# Altium schematic sheet P02_Apollo 4 Plus.SchDoc
size C; SheetNumber: 2; SheetTotal: 3
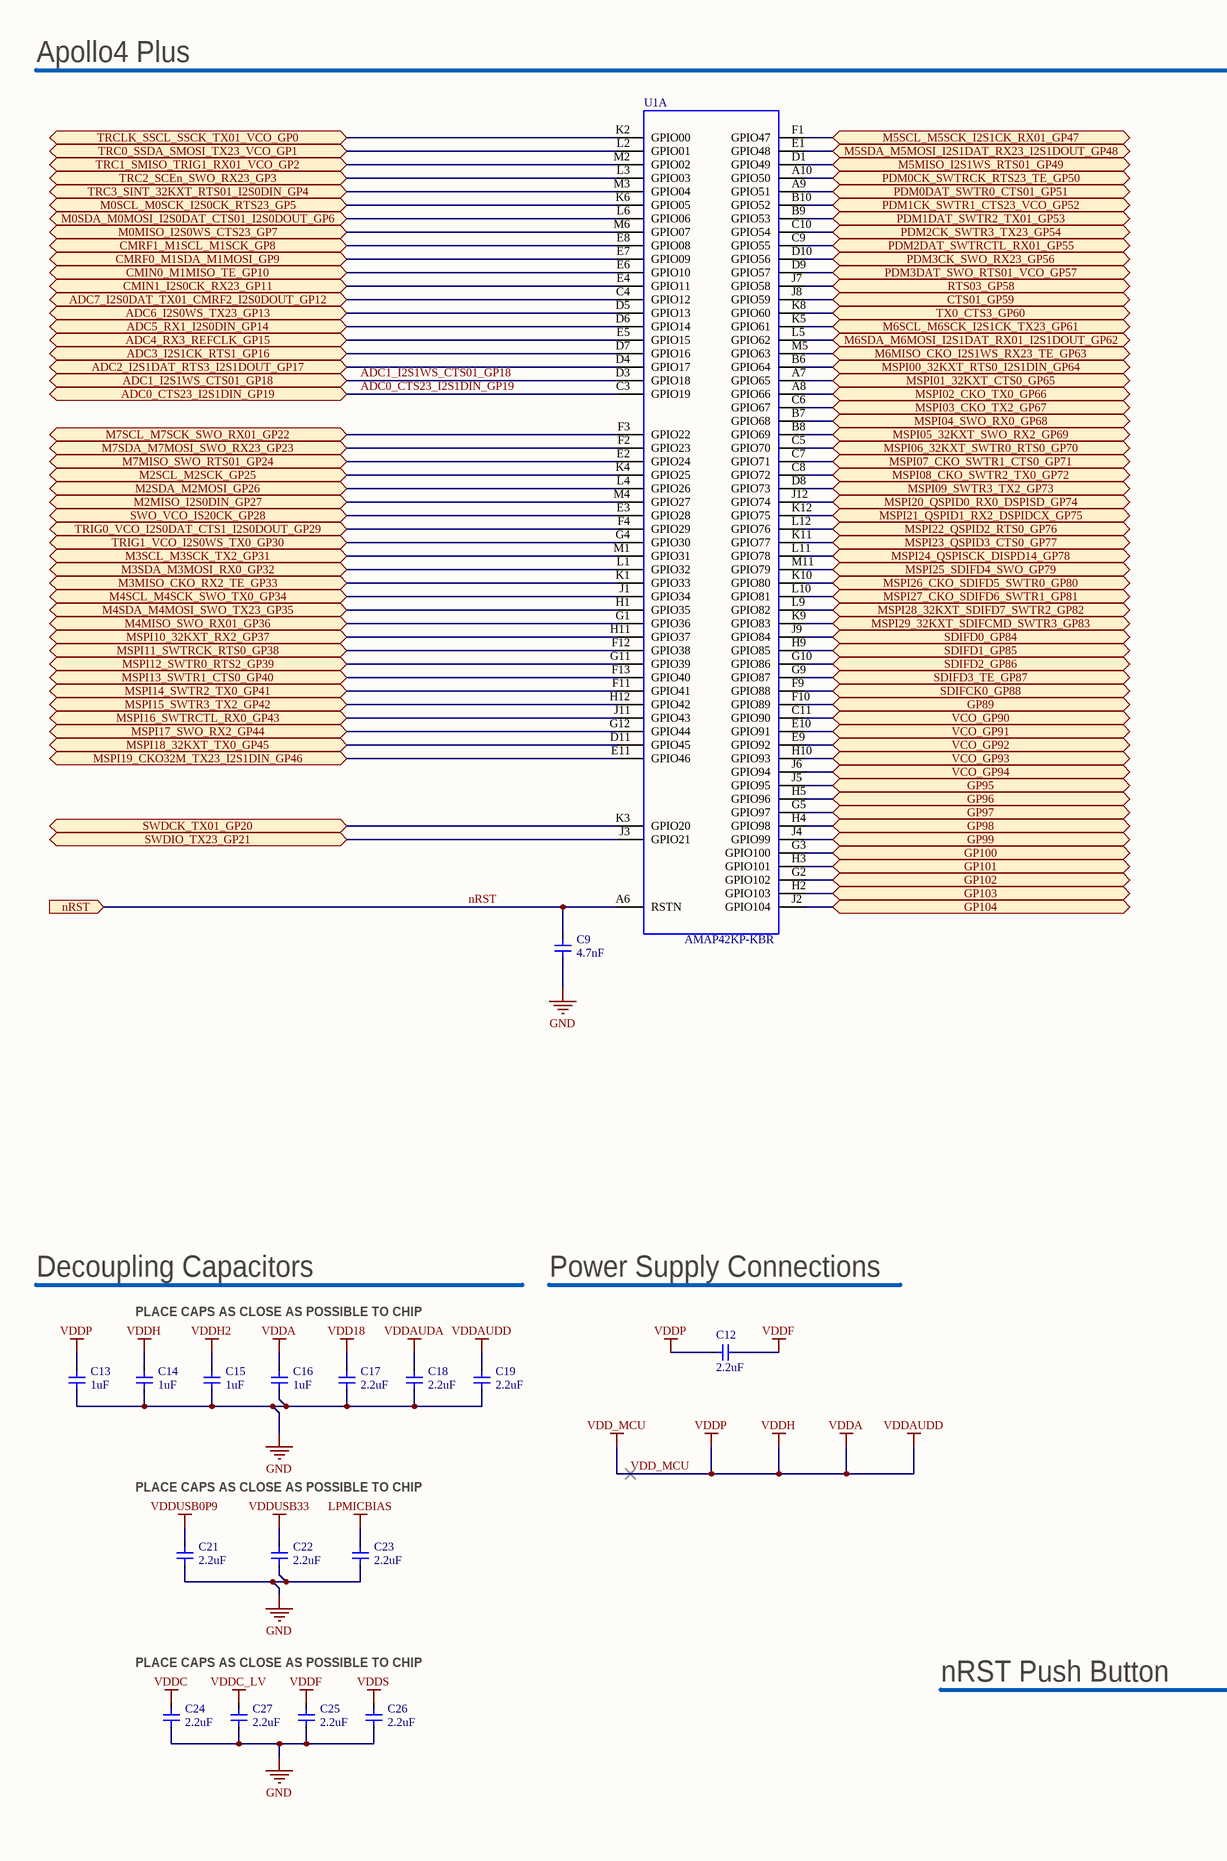
[diagram p0: P02_Apollo 4 Plus.SchDoc, left]
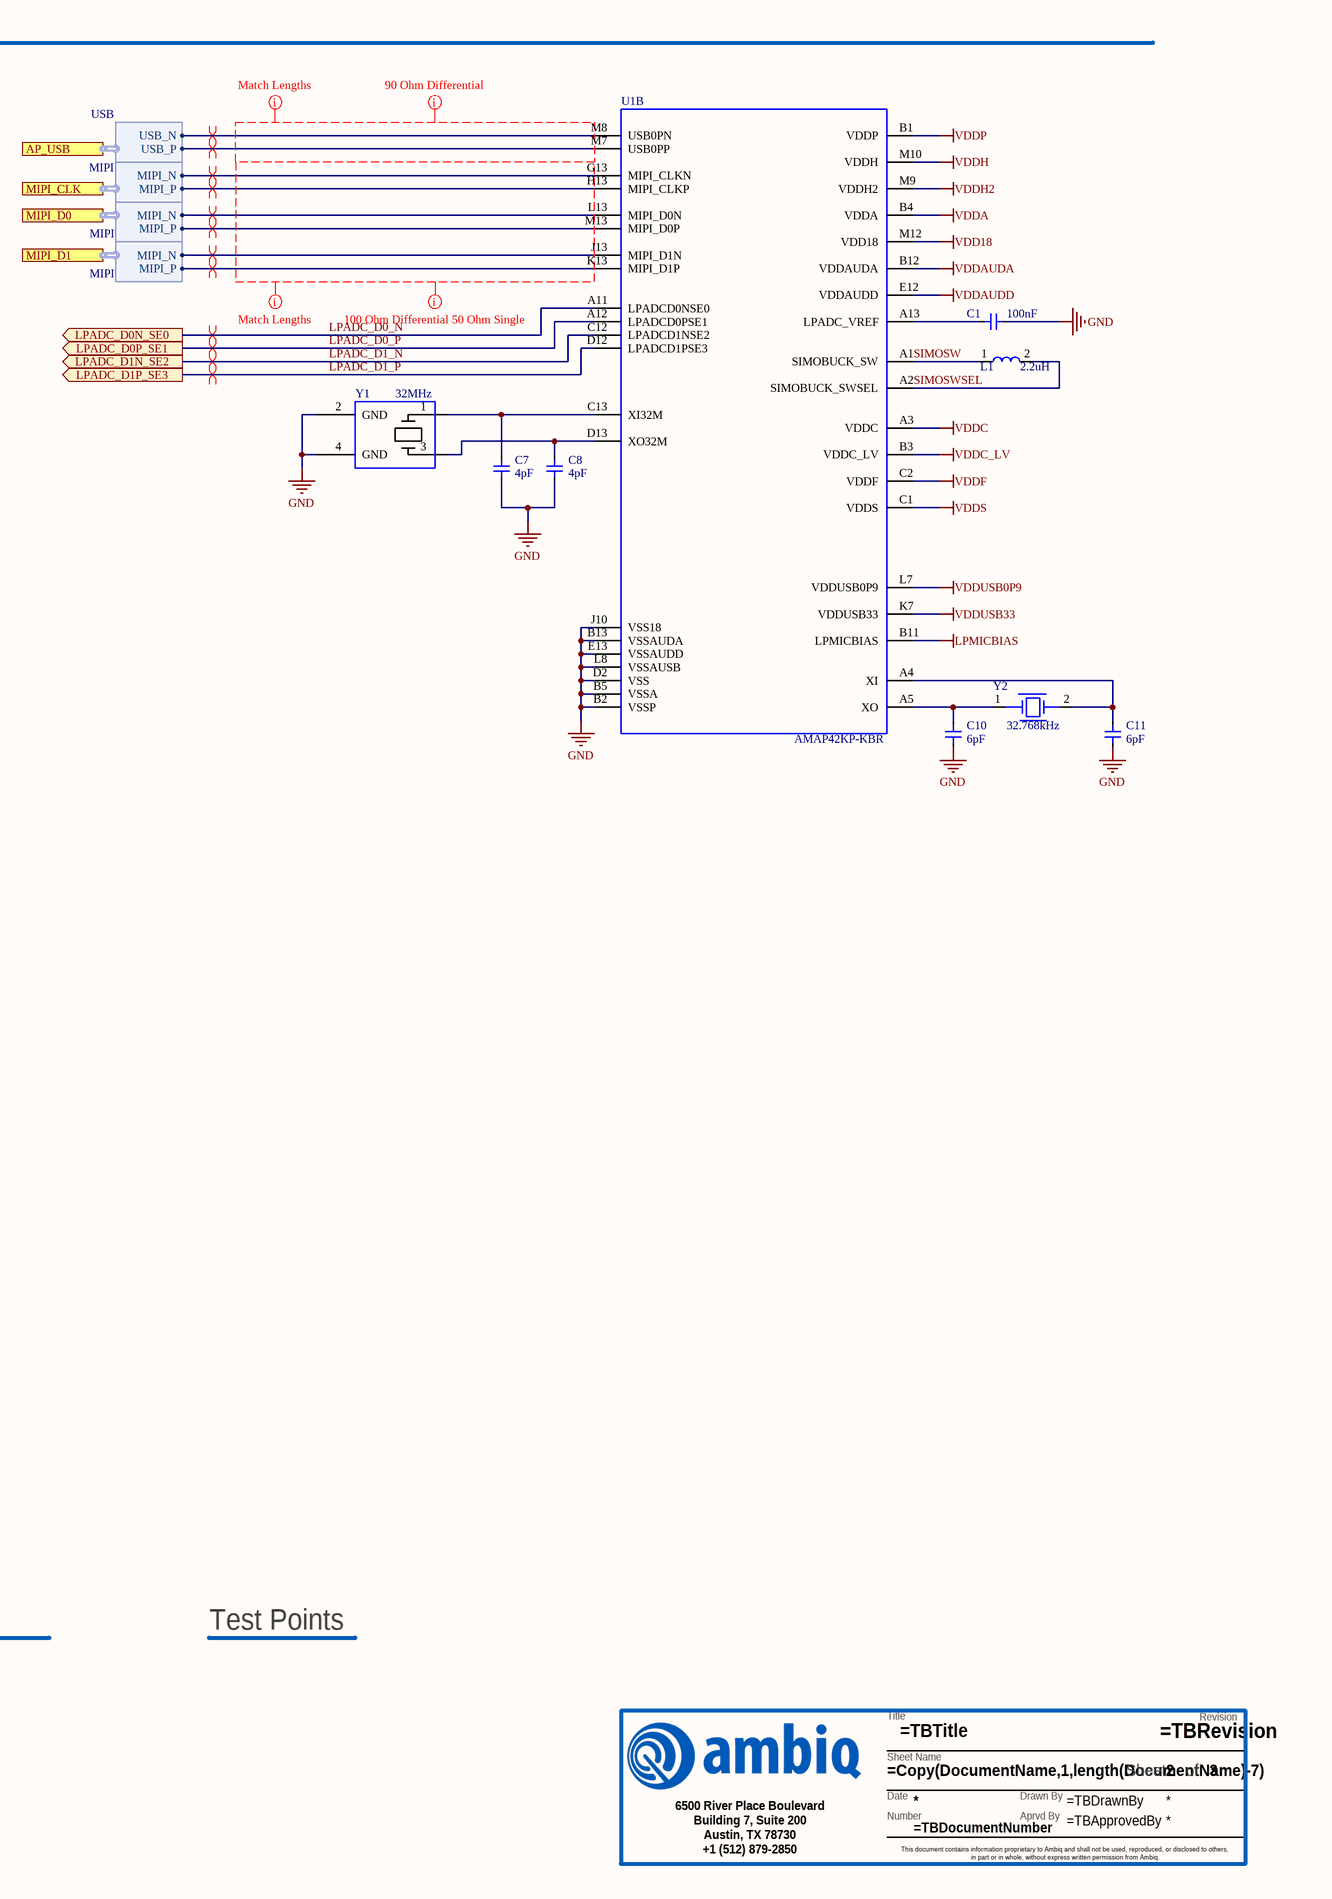
[diagram p1: P02_Apollo 4 Plus.SchDoc, right]

## Parts
?  TitleBlock  (value not drawn)  (graphical)
C1  100nF  [IPC_C]
C7  4pF  [IPC_C]
C8  4pF  [IPC_C]
C9  4.7nF  [IPC_C]
C10  6pF  [IPC_C]
C11  6pF  [IPC_C]
C12  2.2uF  [IPC_C]
C13  1uF  [IPC_C]
C14  1uF  [IPC_C]
C15  1uF  [IPC_C]
C16  1uF  [IPC_C]
C17  2.2uF  [IPC_C]
C18  2.2uF  [IPC_C]
C19  2.2uF  [IPC_C]
C21  2.2uF  [IPC_C]
C22  2.2uF  [IPC_C]
C23  2.2uF  [IPC_C]
C24  2.2uF  [IPC_C]
C25  2.2uF  [IPC_C]
C26  2.2uF  [IPC_C]
C27  2.2uF  [IPC_C]
L1  2.2uH  [IPC_C]
U1  AMAP42KP-KBR  [BGA146C35P13X12_390X430X350]  (parts A,B of 2)
Y1  32MHz  [XOSC_ABM12W_1.2x1.6]
Y2  32.768kHz  [XTAL2-1P6X1P0-SM]

## Ports
ADC0_CTS23_I2S1DIN_GP19 (bidir), ADC1_I2S1WS_CTS01_GP18 (bidir), ADC2_I2S1DAT_RTS3_I2S1DOUT_GP17 (bidir), ADC3_I2S1CK_RTS1_GP16 (bidir), ADC4_RX3_REFCLK_GP15 (bidir), ADC5_RX1_I2S0DIN_GP14 (bidir), ADC6_I2S0WS_TX23_GP13 (bidir), ADC7_I2S0DAT_TX01_CMRF2_I2S0DOUT_GP12 (bidir), AP_USB (harness USB), CMIN0_M1MISO_TE_GP10 (bidir), CMIN1_I2S0CK_RX23_GP11 (bidir), CMRF0_M1SDA_M1MOSI_GP9 (bidir), CMRF1_M1SCL_M1SCK_GP8 (bidir), CTS01_GP59 (bidir), GP89 (bidir), GP95 (bidir), GP96 (bidir), GP97 (bidir), GP98 (bidir), GP99 (bidir), GP100 (bidir), GP101 (bidir), GP102 (bidir), GP103 (bidir), GP104 (bidir), LPADC_D0N_SE0 (out), LPADC_D0P_SE1 (out), LPADC_D1N_SE2 (out), LPADC_D1P_SE3 (out), M0MISO_I2S0WS_CTS23_GP7 (bidir), M0SCL_M0SCK_I2S0CK_RTS23_GP5 (bidir), M0SDA_M0MOSI_I2S0DAT_CTS01_I2S0DOUT_GP6 (bidir), M2MISO_I2S0DIN_GP27 (bidir), M2SCL_M2SCK_GP25 (bidir), M2SDA_M2MOSI_GP26 (bidir), M3MISO_CKO_RX2_TE_GP33 (bidir), M3SCL_M3SCK_TX2_GP31 (bidir), M3SDA_M3MOSI_RX0_GP32 (bidir), M4MISO_SWO_RX01_GP36 (bidir), M4SCL_M4SCK_SWO_TX0_GP34 (bidir), M4SDA_M4MOSI_SWO_TX23_GP35 (bidir), M5MISO_I2S1WS_RTS01_GP49 (bidir), M5SCL_M5SCK_I2S1CK_RX01_GP47 (bidir), M5SDA_M5MOSI_I2S1DAT_RX23_I2S1DOUT_GP48 (bidir), M6MISO_CKO_I2S1WS_RX23_TE_GP63 (bidir), M6SCL_M6SCK_I2S1CK_TX23_GP61 (bidir), M6SDA_M6MOSI_I2S1DAT_RX01_I2S1DOUT_GP62 (bidir), M7MISO_SWO_RTS01_GP24 (bidir), M7SCL_M7SCK_SWO_RX01_GP22 (bidir), M7SDA_M7MOSI_SWO_RX23_GP23 (bidir), MIPI_CLK (harness MIPI), MIPI_D0 (harness MIPI), MIPI_D1 (harness MIPI), MSPI00_32KXT_RTS0_I2S1DIN_GP64 (bidir), MSPI01_32KXT_CTS0_GP65 (bidir), MSPI02_CKO_TX0_GP66 (bidir), MSPI03_CKO_TX2_GP67 (bidir), MSPI04_SWO_RX0_GP68 (bidir), MSPI05_32KXT_SWO_RX2_GP69 (bidir), MSPI06_32KXT_SWTR0_RTS0_GP70 (bidir), MSPI07_CKO_SWTR1_CTS0_GP71 (bidir), MSPI08_CKO_SWTR2_TX0_GP72 (bidir), MSPI09_SWTR3_TX2_GP73 (bidir), MSPI10_32KXT_RX2_GP37 (bidir), MSPI11_SWTRCK_RTS0_GP38 (bidir), MSPI12_SWTR0_RTS2_GP39 (bidir), MSPI13_SWTR1_CTS0_GP40 (bidir), MSPI14_SWTR2_TX0_GP41 (bidir), MSPI15_SWTR3_TX2_GP42 (bidir), MSPI16_SWTRCTL_RX0_GP43 (bidir), MSPI17_SWO_RX2_GP44 (bidir), MSPI18_32KXT_TX0_GP45 (bidir), MSPI19_CKO32M_TX23_I2S1DIN_GP46 (bidir), MSPI20_QSPID0_RX0_DSPISD_GP74 (bidir), MSPI21_QSPID1_RX2_DSPIDCX_GP75 (bidir), MSPI22_QSPID2_RTS0_GP76 (bidir), MSPI23_QSPID3_CTS0_GP77 (bidir), MSPI24_QSPISCK_DISPD14_GP78 (bidir), MSPI25_SDIFD4_SWO_GP79 (bidir), MSPI26_CKO_SDIFD5_SWTR0_GP80 (bidir), MSPI27_CKO_SDIFD6_SWTR1_GP81 (bidir), MSPI28_32KXT_SDIFD7_SWTR2_GP82 (bidir), MSPI29_32KXT_SDIFCMD_SWTR3_GP83 (bidir), nRST (in), PDM0CK_SWTRCK_RTS23_TE_GP50 (bidir), PDM0DAT_SWTR0_CTS01_GP51 (bidir), PDM1CK_SWTR1_CTS23_VCO_GP52 (bidir), PDM1DAT_SWTR2_TX01_GP53 (bidir), PDM2CK_SWTR3_TX23_GP54 (bidir), PDM2DAT_SWTRCTL_RX01_GP55 (bidir), PDM3CK_SWO_RX23_GP56 (bidir), PDM3DAT_SWO_RTS01_VCO_GP57 (bidir), RTS03_GP58 (bidir), SDIFCK0_GP88 (bidir), SDIFD0_GP84 (bidir), SDIFD1_GP85 (bidir), SDIFD2_GP86 (bidir), SDIFD3_TE_GP87 (bidir), SWDCK_TX01_GP20 (bidir), SWDIO_TX23_GP21 (bidir), SWO_VCO_IS20CK_GP28 (bidir), TRC0_SSDA_SMOSI_TX23_VCO_GP1 (bidir), TRC1_SMISO_TRIG1_RX01_VCO_GP2 (bidir), TRC2_SCEn_SWO_RX23_GP3 (bidir), TRC3_SINT_32KXT_RTS01_I2S0DIN_GP4 (bidir), TRCLK_SSCL_SSCK_TX01_VCO_GP0 (bidir), TRIG0_VCO_I2S0DAT_CTS1_I2S0DOUT_GP29 (bidir), TRIG1_VCO_I2S0WS_TX0_GP30 (bidir), TX0_CTS3_GP60 (bidir), VCO_GP90 (bidir), VCO_GP91 (bidir), VCO_GP92 (bidir), VCO_GP93 (bidir), VCO_GP94 (bidir)

## Harnesses
USB: USB_N, USB_P
MIPI: MIPI_N, MIPI_P

## Nets
GND: C1.2 C7.2 C8.2 C9.2 C10.2 C11.2 C13.2 C14.2 C15.2 C16.2 C17.2 C18.2 C19.2 C21.2 C22.2 C23.2 C24.2 C25.2 C26.2 C27.2 U1.B2(VSSP) U1.B5(VSSA) U1.B13(VSSAUDA) U1.D2(VSS) U1.E13(VSSAUDD) U1.J10(VSS18) U1.L8(VSSAUSB) Y1.2(GND) Y1.4(GND)
LPMICBIAS: C23.1 U1.B11(LPMICBIAS)
VDD18: C17.1 U1.M12(VDD18)
VDD_MCU: C12.1 C13.1 C14.1 C16.1 C19.1 U1.B1(VDDP) U1.B4(VDDA) U1.E12(VDDAUDD) U1.M10(VDDH)  [also labelled VDDA, VDDAUDD, VDDH, VDDP]
VDDAUDA: C18.1 U1.B12(VDDAUDA)
VDDC: C24.1 U1.A3(VDDC)
VDDC_LV: C27.1 U1.B3(VDDC_LV)
VDDF: C12.2 C25.1 U1.C2(VDDF)
VDDH2: C15.1 U1.M9(VDDH2)
VDDS: C26.1 U1.C1(VDDS)
VDDUSB0P9: C21.1 U1.L7(VDDUSB0P9)
VDDUSB33: C22.1 U1.K7(VDDUSB33)
ADC0_CTS23_I2S1DIN_GP19: U1.C3(GPIO19) ; port ADC0_CTS23_I2S1DIN_GP19
ADC1_I2S1WS_CTS01_GP18: U1.D3(GPIO18) ; port ADC1_I2S1WS_CTS01_GP18
ADC2_I2S1DAT_RTS3_I2S1DOUT_GP17: U1.D4(GPIO17) ; port ADC2_I2S1DAT_RTS3_I2S1DOUT_GP17
ADC3_I2S1CK_RTS1_GP16: U1.D7(GPIO16) ; port ADC3_I2S1CK_RTS1_GP16
ADC4_RX3_REFCLK_GP15: U1.E5(GPIO15) ; port ADC4_RX3_REFCLK_GP15
ADC5_RX1_I2S0DIN_GP14: U1.D6(GPIO14) ; port ADC5_RX1_I2S0DIN_GP14
ADC6_I2S0WS_TX23_GP13: U1.D5(GPIO13) ; port ADC6_I2S0WS_TX23_GP13
ADC7_I2S0DAT_TX01_CMRF2_I2S0DOUT_GP12: U1.C4(GPIO12) ; port ADC7_I2S0DAT_TX01_CMRF2_I2S0DOUT_GP12
CMIN0_M1MISO_TE_GP10: U1.E6(GPIO10) ; port CMIN0_M1MISO_TE_GP10
CMIN1_I2S0CK_RX23_GP11: U1.E4(GPIO11) ; port CMIN1_I2S0CK_RX23_GP11
CMRF0_M1SDA_M1MOSI_GP9: U1.E7(GPIO09) ; port CMRF0_M1SDA_M1MOSI_GP9
CMRF1_M1SCL_M1SCK_GP8: U1.E8(GPIO08) ; port CMRF1_M1SCL_M1SCK_GP8
CTS01_GP59: U1.J8(GPIO59) ; port CTS01_GP59
GP89: U1.F10(GPIO89) ; port GP89
GP95: U1.J5(GPIO95) ; port GP95
GP96: U1.H5(GPIO96) ; port GP96
GP97: U1.G5(GPIO97) ; port GP97
GP98: U1.H4(GPIO98) ; port GP98
GP99: U1.J4(GPIO99) ; port GP99
GP100: U1.G3(GPIO100) ; port GP100
GP101: U1.H3(GPIO101) ; port GP101
GP102: U1.G2(GPIO102) ; port GP102
GP103: U1.H2(GPIO103) ; port GP103
GP104: U1.J2(GPIO104) ; port GP104
LPADC_D0_N: U1.A11(LPADCD0NSE0) ; port LPADC_D0N_SE0
LPADC_D0_P: U1.A12(LPADCD0PSE1) ; port LPADC_D0P_SE1
LPADC_D1_N: U1.C12(LPADCD1NSE2) ; port LPADC_D1N_SE2
LPADC_D1_P: U1.D12(LPADCD1PSE3) ; port LPADC_D1P_SE3
M0MISO_I2S0WS_CTS23_GP7: U1.M6(GPIO07) ; port M0MISO_I2S0WS_CTS23_GP7
M0SCL_M0SCK_I2S0CK_RTS23_GP5: U1.K6(GPIO05) ; port M0SCL_M0SCK_I2S0CK_RTS23_GP5
M0SDA_M0MOSI_I2S0DAT_CTS01_I2S0DOUT_GP6: U1.L6(GPIO06) ; port M0SDA_M0MOSI_I2S0DAT_CTS01_I2S0DOUT_GP6
M2MISO_I2S0DIN_GP27: U1.M4(GPIO27) ; port M2MISO_I2S0DIN_GP27
M2SCL_M2SCK_GP25: U1.K4(GPIO25) ; port M2SCL_M2SCK_GP25
M2SDA_M2MOSI_GP26: U1.L4(GPIO26) ; port M2SDA_M2MOSI_GP26
M3MISO_CKO_RX2_TE_GP33: U1.K1(GPIO33) ; port M3MISO_CKO_RX2_TE_GP33
M3SCL_M3SCK_TX2_GP31: U1.M1(GPIO31) ; port M3SCL_M3SCK_TX2_GP31
M3SDA_M3MOSI_RX0_GP32: U1.L1(GPIO32) ; port M3SDA_M3MOSI_RX0_GP32
M4MISO_SWO_RX01_GP36: U1.G1(GPIO36) ; port M4MISO_SWO_RX01_GP36
M4SCL_M4SCK_SWO_TX0_GP34: U1.J1(GPIO34) ; port M4SCL_M4SCK_SWO_TX0_GP34
M4SDA_M4MOSI_SWO_TX23_GP35: U1.H1(GPIO35) ; port M4SDA_M4MOSI_SWO_TX23_GP35
M5MISO_I2S1WS_RTS01_GP49: U1.D1(GPIO49) ; port M5MISO_I2S1WS_RTS01_GP49
M5SCL_M5SCK_I2S1CK_RX01_GP47: U1.F1(GPIO47) ; port M5SCL_M5SCK_I2S1CK_RX01_GP47
M5SDA_M5MOSI_I2S1DAT_RX23_I2S1DOUT_GP48: U1.E1(GPIO48) ; port M5SDA_M5MOSI_I2S1DAT_RX23_I2S1DOUT_GP48
M6MISO_CKO_I2S1WS_RX23_TE_GP63: U1.M5(GPIO63) ; port M6MISO_CKO_I2S1WS_RX23_TE_GP63
M6SCL_M6SCK_I2S1CK_TX23_GP61: U1.K5(GPIO61) ; port M6SCL_M6SCK_I2S1CK_TX23_GP61
M6SDA_M6MOSI_I2S1DAT_RX01_I2S1DOUT_GP62: U1.L5(GPIO62) ; port M6SDA_M6MOSI_I2S1DAT_RX01_I2S1DOUT_GP62
M7MISO_SWO_RTS01_GP24: U1.E2(GPIO24) ; port M7MISO_SWO_RTS01_GP24
M7SCL_M7SCK_SWO_RX01_GP22: U1.F3(GPIO22) ; port M7SCL_M7SCK_SWO_RX01_GP22
M7SDA_M7MOSI_SWO_RX23_GP23: U1.F2(GPIO23) ; port M7SDA_M7MOSI_SWO_RX23_GP23
MSPI00_32KXT_RTS0_I2S1DIN_GP64: U1.B6(GPIO64) ; port MSPI00_32KXT_RTS0_I2S1DIN_GP64
MSPI01_32KXT_CTS0_GP65: U1.A7(GPIO65) ; port MSPI01_32KXT_CTS0_GP65
MSPI02_CKO_TX0_GP66: U1.A8(GPIO66) ; port MSPI02_CKO_TX0_GP66
MSPI03_CKO_TX2_GP67: U1.C6(GPIO67) ; port MSPI03_CKO_TX2_GP67
MSPI04_SWO_RX0_GP68: U1.B7(GPIO68) ; port MSPI04_SWO_RX0_GP68
MSPI05_32KXT_SWO_RX2_GP69: U1.B8(GPIO69) ; port MSPI05_32KXT_SWO_RX2_GP69
MSPI06_32KXT_SWTR0_RTS0_GP70: U1.C5(GPIO70) ; port MSPI06_32KXT_SWTR0_RTS0_GP70
MSPI07_CKO_SWTR1_CTS0_GP71: U1.C7(GPIO71) ; port MSPI07_CKO_SWTR1_CTS0_GP71
MSPI08_CKO_SWTR2_TX0_GP72: U1.C8(GPIO72) ; port MSPI08_CKO_SWTR2_TX0_GP72
MSPI09_SWTR3_TX2_GP73: U1.D8(GPIO73) ; port MSPI09_SWTR3_TX2_GP73
MSPI10_32KXT_RX2_GP37: U1.H11(GPIO37) ; port MSPI10_32KXT_RX2_GP37
MSPI11_SWTRCK_RTS0_GP38: U1.F12(GPIO38) ; port MSPI11_SWTRCK_RTS0_GP38
MSPI12_SWTR0_RTS2_GP39: U1.G11(GPIO39) ; port MSPI12_SWTR0_RTS2_GP39
MSPI13_SWTR1_CTS0_GP40: U1.F13(GPIO40) ; port MSPI13_SWTR1_CTS0_GP40
MSPI14_SWTR2_TX0_GP41: U1.F11(GPIO41) ; port MSPI14_SWTR2_TX0_GP41
MSPI15_SWTR3_TX2_GP42: U1.H12(GPIO42) ; port MSPI15_SWTR3_TX2_GP42
MSPI16_SWTRCTL_RX0_GP43: U1.J11(GPIO43) ; port MSPI16_SWTRCTL_RX0_GP43
MSPI17_SWO_RX2_GP44: U1.G12(GPIO44) ; port MSPI17_SWO_RX2_GP44
MSPI18_32KXT_TX0_GP45: U1.D11(GPIO45) ; port MSPI18_32KXT_TX0_GP45
MSPI19_CKO32M_TX23_I2S1DIN_GP46: U1.E11(GPIO46) ; port MSPI19_CKO32M_TX23_I2S1DIN_GP46
MSPI20_QSPID0_RX0_DSPISD_GP74: U1.J12(GPIO74) ; port MSPI20_QSPID0_RX0_DSPISD_GP74
MSPI21_QSPID1_RX2_DSPIDCX_GP75: U1.K12(GPIO75) ; port MSPI21_QSPID1_RX2_DSPIDCX_GP75
MSPI22_QSPID2_RTS0_GP76: U1.L12(GPIO76) ; port MSPI22_QSPID2_RTS0_GP76
MSPI23_QSPID3_CTS0_GP77: U1.K11(GPIO77) ; port MSPI23_QSPID3_CTS0_GP77
MSPI24_QSPISCK_DISPD14_GP78: U1.L11(GPIO78) ; port MSPI24_QSPISCK_DISPD14_GP78
MSPI25_SDIFD4_SWO_GP79: U1.M11(GPIO79) ; port MSPI25_SDIFD4_SWO_GP79
MSPI26_CKO_SDIFD5_SWTR0_GP80: U1.K10(GPIO80) ; port MSPI26_CKO_SDIFD5_SWTR0_GP80
MSPI27_CKO_SDIFD6_SWTR1_GP81: U1.L10(GPIO81) ; port MSPI27_CKO_SDIFD6_SWTR1_GP81
MSPI28_32KXT_SDIFD7_SWTR2_GP82: U1.L9(GPIO82) ; port MSPI28_32KXT_SDIFD7_SWTR2_GP82
MSPI29_32KXT_SDIFCMD_SWTR3_GP83: U1.K9(GPIO83) ; port MSPI29_32KXT_SDIFCMD_SWTR3_GP83
nRST: C9.1 U1.A6(RSTN) ; port nRST
PDM0CK_SWTRCK_RTS23_TE_GP50: U1.A10(GPIO50) ; port PDM0CK_SWTRCK_RTS23_TE_GP50
PDM0DAT_SWTR0_CTS01_GP51: U1.A9(GPIO51) ; port PDM0DAT_SWTR0_CTS01_GP51
PDM1CK_SWTR1_CTS23_VCO_GP52: U1.B10(GPIO52) ; port PDM1CK_SWTR1_CTS23_VCO_GP52
PDM1DAT_SWTR2_TX01_GP53: U1.B9(GPIO53) ; port PDM1DAT_SWTR2_TX01_GP53
PDM2CK_SWTR3_TX23_GP54: U1.C10(GPIO54) ; port PDM2CK_SWTR3_TX23_GP54
PDM2DAT_SWTRCTL_RX01_GP55: U1.C9(GPIO55) ; port PDM2DAT_SWTRCTL_RX01_GP55
PDM3CK_SWO_RX23_GP56: U1.D10(GPIO56) ; port PDM3CK_SWO_RX23_GP56
PDM3DAT_SWO_RTS01_VCO_GP57: U1.D9(GPIO57) ; port PDM3DAT_SWO_RTS01_VCO_GP57
RTS03_GP58: U1.J7(GPIO58) ; port RTS03_GP58
SDIFCK0_GP88: U1.F9(GPIO88) ; port SDIFCK0_GP88
SDIFD0_GP84: U1.J9(GPIO84) ; port SDIFD0_GP84
SDIFD1_GP85: U1.H9(GPIO85) ; port SDIFD1_GP85
SDIFD2_GP86: U1.G10(GPIO86) ; port SDIFD2_GP86
SDIFD3_TE_GP87: U1.G9(GPIO87) ; port SDIFD3_TE_GP87
SIMOSW: L1.1 U1.A1(SIMOBUCK_SW)
SIMOSWSEL: L1.2 U1.A2(SIMOBUCK_SWSEL)
SWDCK_TX01_GP20: U1.K3(GPIO20) ; port SWDCK_TX01_GP20
SWDIO_TX23_GP21: U1.J3(GPIO21) ; port SWDIO_TX23_GP21
SWO_VCO_IS20CK_GP28: U1.E3(GPIO28) ; port SWO_VCO_IS20CK_GP28
TRC0_SSDA_SMOSI_TX23_VCO_GP1: U1.L2(GPIO01) ; port TRC0_SSDA_SMOSI_TX23_VCO_GP1
TRC1_SMISO_TRIG1_RX01_VCO_GP2: U1.M2(GPIO02) ; port TRC1_SMISO_TRIG1_RX01_VCO_GP2
TRC2_SCEn_SWO_RX23_GP3: U1.L3(GPIO03) ; port TRC2_SCEn_SWO_RX23_GP3
TRC3_SINT_32KXT_RTS01_I2S0DIN_GP4: U1.M3(GPIO04) ; port TRC3_SINT_32KXT_RTS01_I2S0DIN_GP4
TRCLK_SSCL_SSCK_TX01_VCO_GP0: U1.K2(GPIO00) ; port TRCLK_SSCL_SSCK_TX01_VCO_GP0
TRIG0_VCO_I2S0DAT_CTS1_I2S0DOUT_GP29: U1.F4(GPIO29) ; port TRIG0_VCO_I2S0DAT_CTS1_I2S0DOUT_GP29
TRIG1_VCO_I2S0WS_TX0_GP30: U1.G4(GPIO30) ; port TRIG1_VCO_I2S0WS_TX0_GP30
TX0_CTS3_GP60: U1.K8(GPIO60) ; port TX0_CTS3_GP60
VCO_GP90: U1.C11(GPIO90) ; port VCO_GP90
VCO_GP91: U1.E10(GPIO91) ; port VCO_GP91
VCO_GP92: U1.E9(GPIO92) ; port VCO_GP92
VCO_GP93: U1.H10(GPIO93) ; port VCO_GP93
VCO_GP94: U1.J6(GPIO94) ; port VCO_GP94
NetC1_1: C1.1 U1.A13(LPADC_VREF)
NetC7_1: C7.1 U1.C13(XI32M) Y1.1
NetC8_1: C8.1 U1.D13(XO32M) Y1.3
NetC10_1: C10.1 U1.A5(XO) Y2.1
NetC11_1: C11.1 U1.A4(XI) Y2.2
NetU1_G13: U1.G13(MIPI_CLKN) ; port MIPI_CLK.MIPI_N
NetU1_H13: U1.H13(MIPI_CLKP) ; port MIPI_CLK.MIPI_P
NetU1_J13: U1.J13(MIPI_D1N) ; port MIPI_D1.MIPI_N
NetU1_K13: U1.K13(MIPI_D1P) ; port MIPI_D1.MIPI_P
NetU1_L13: U1.L13(MIPI_D0N) ; port MIPI_D0.MIPI_N
NetU1_M7: U1.M7(USB0PP) ; port AP_USB.USB_P
NetU1_M8: U1.M8(USB0PN) ; port AP_USB.USB_N
NetU1_M13: U1.M13(MIPI_D0P) ; port MIPI_D0.MIPI_P

## Layout directives
differential pair; differential pair class AP_USB: NetU1_M7, NetU1_M8
rule Impedance Constraint [Min = 85.00    Max = 95.00    ]; rule Differential Pairs Routing [Pref Gap = 6mil    Min Gap  = 5mil    Max Gap  = 7milPref Width = 4mil    Min Width  = 4mil    Max Width  = 4mil]; net class AP4_USB: (no net found under the mark)
rule Impedance Constraint [Min = 95.00    Max = 105.0    ]: (no net found under the mark)
rule Matched Net Lengths [Tolerance = 100mil]: (no net found under the mark)
differential pair; differential pair class MIPI_CLK: NetU1_G13, NetU1_H13
differential pair; differential pair class MIPI_D0: NetU1_L13, NetU1_M13
differential pair; differential pair class MIPI_D1: NetU1_J13, NetU1_K13
differential pair; differential pair class LPADC_D1; rule Differential Pairs Routing [Pref Gap = 5mil    Min Gap  = 3mil    Max Gap  = 10milPref Width = 4mil    Min Width  = 3mil    Max Width  = 15mil]: LPADC_D1_N, LPADC_D1_P
differential pair; differential pair class LPADC_D0; rule Differential Pairs Routing [Pref Gap = 5mil    Min Gap  = 3mil    Max Gap  = 10milPref Width = 4mil    Min Width  = 3mil    Max Width  = 15mil]: LPADC_D0_N, LPADC_D0_P

## Notes on the sheet
- Apollo4 Plus
- Decoupling Capacitors
- PLACE CAPS AS CLOSE AS POSSIBLE TO CHIP
- Power Supply Connections
- nRST Push Button
- Test Points
- (in symbol TitleBlock) Revision; Title; Sheet Name; Sheet; of; Date; Drawn By; Number; Aprvd By; 6500 River Place Boulevard / Building 7, Suite 200 / Austin, TX 78730 / +1 (512) 879-2850; This document contains information proprietary to Ambiq and shall not be used, reproduced, or disclosed to others, / in part or in whole, without express written permission from Ambiq.

## Library data of the parts
? = TitleBlock: Title block for Ambiq Schematics. Please have the following parameters entered in Project>Project Options>Parameters: / TBTitle / TBDocumentNumber / TBRevision / TBDrawnBy / TBApprovedBy; AMBIQ PN: TitleBlock
C1 = 0201ZD104KAT2A: NONE; Manufacturer: Kyocera AVX; Tolerance: 10%; Voltage Rating: 10V; AMBIQ PN: 0201ZD104KAT2A; Supplier 1: Arrow Electronics; Supplier Part Number 1: 0201ZD104KAT2A; Manufacturer Part Number: 0201ZD104KAT2A; RoHS: Yes; Category: Ceramic Capacitors; Stock 1: 105000; Pricing 1: 15000=0.00770, 30000=0.00750, 45000=0.00740, 60000=0.00720, 75000=0.00690, 150000=0.00620 (USD); Mount: Surface Mount; Case/Package: 0201; Case Code (Metric): 0603; Case Code (Imperial): 0201; Min Operating Temperature: -55°C; Max Operating Temperature: 85°C; Capacitance: 100nF; Packaging: Tape and Reel; Voltage Rating (DC): 10V; Series: -; Lead Free: Lead Free; RoHS Compliant: Yes; ComponentLink1URL: http://www.mouser.com/ds/2/40/cx5r-776519.pdf?src-supplier=Mouser; ComponentLink1Description: http://www.mouser.com/ds/2/40/cx5r-776519.pdf?src-supplier=Mouser
C7 C8 = GRM0335C1H4R0BA01D: NONE; Manufacturer: Murata; Voltage Rating: 50V; Dielectric: C0G; AMBIQ PN: GRM0335C1H4R0BA01D; Supplier 1: Arrow Electronics; Supplier Part Number 1: GRM0335C1H4R0BA01D; Manufacturer Part Number: GRM0335C1H4R0BA01D; RoHS: Yes; Category: Ceramic Capacitors; Stock 1: 3508; Pricing 1: 1=0.09680, 10=0.01620, 25=0.01560, 100=0.00890, 250=0.00860, 500=0.00620, 3000=0.00530 (USD); Mount: Surface Mount; Case/Package: 0201; Case Code (Metric): 0603; Case Code (Imperial): 0201; Min Operating Temperature: -55°C; Max Operating Temperature: 125°C; Capacitance: 4pF; Packaging: Tape and Reel; Voltage Rating (DC): 50V; Series: GRM; Length: 0.6mm; Width: 0.012inch; Height: 0.3mm; Thickness: 0.013inch; Depth: 0.3mm; ComponentLink1URL: http://www.mouser.com/ds/2/281/c02e-2905.pdf?src-supplier=Mouser; ComponentLink1Description: http://www.mouser.com/ds/2/281/c02e-2905.pdf?src-supplier=Mouser; Package Quantity: 15000; Termination: SMD/SMT
C9 = GRM155R61C472KA01D: NONE; Manufacturer: Murata; Tolerance: 10%; Voltage Rating: 16V; Dielectric: X5R; AMBIQ PN: GRM155R61C472KA01D; Supplier 1: Arrow Electronics; Supplier Part Number 1: GRM155R61C472KA01D; Manufacturer Part Number: GRM155R61C472KA01D; RoHS: Yes; Category: Ceramic Capacitors; Stock 1: 3; Pricing 1: 1=0.07090 (USD); Mount: Surface Mount; Case/Package: 0402; Case Code (Metric): 1005; Case Code (Imperial): 0402; Min Operating Temperature: -55°C; Max Operating Temperature: 85°C; Capacitance: 4.7nF; Packaging: Tape and Reel; Voltage Rating (DC): 16V; Series: GRM; Construction: Flat; Length: 1mm; Width: 0.02inch; Height: 0.5mm; Thickness: 0.022inch; Depth: 0.5mm; Radiation Hardening: No; RoHS Compliant: Yes; ComponentLink1URL: https://datasheet.ciiva.com/11620/product-11620403.pdf?src-supplier=Avnet; ComponentLink1Description: https://datasheet.ciiva.com/11620/product-11620403.pdf?src-supplier=Avnet; Package Quantity: 10000; Termination: SMD/SMT
C10 C11 = GRM0335C1H6R0BA01D: NONE; Manufacturer: Murata; Voltage Rating: 50V; Dielectric: C0G; AMBIQ PN: GRM0335C1H6R0BA01D; Supplier 1: Arrow Electronics; Supplier Part Number 1: GRM0335C1H6R0BA01D; Manufacturer Part Number: GRM0335C1H6R0BA01D; RoHS: Yes; Category: Ceramic Capacitors; Stock 1: 4052; Pricing 1: 1=0.06400, 10=0.01810, 25=0.01250, 100=0.00850, 250=0.00840, 500=0.00620, 1000=0.00510, 3000=0.00460 (USD); Mount: Surface Mount; Case/Package: 0201; Case Code (Metric): 0603; Case Code (Imperial): 0201; Min Operating Temperature: -55°C; Max Operating Temperature: 125°C; Capacitance: 6pF; Packaging: Tape and Reel; Voltage Rating (DC): 50V; Series: GRM; Length: 0.024inch; Width: 0.012inch; Height: 0.3mm; Thickness: 0.013inch; RoHS Compliant: Yes; ComponentLink1URL: http://www.mouser.com/ds/2/281/c02e-2905.pdf?src-supplier=Mouser; ComponentLink1Description: http://www.mouser.com/ds/2/281/c02e-2905.pdf?src-supplier=Mouser; Package Quantity: 15000; Termination: SMD/SMT
C12 C17-C19 C21-C27 = GRM033R61A225KE47D: NONE; Manufacturer: Murata; Tolerance: 10%; Voltage Rating: 10V; Dielectric: X5R; AMBIQ PN: GRM033R61A225KE47D; Supplier 1: Arrow Electronics; Supplier Part Number 1: GRM033R61A225KE47D; Manufacturer Part Number: GRM033R61A225KE47D; RoHS: Yes; Category: Ceramic Capacitors; Stock 1: 990; Pricing 1: 1=0.27590, 10=0.23000, 25=0.18010, 100=0.10000, 250=0.09900, 500=0.06860, 1000=0.06790, 3000=0.06720, 6000=0.05140, 15000=0.050; Mount: Surface Mount; Case/Package: 0201; Case Code (Metric): 0603; Case Code (Imperial): 0201; Min Operating Temperature: -55°C; Max Operating Temperature: 85°C; Capacitance: 2.2uF; Packaging: Tape and Reel; Voltage Rating (DC): 10V; Length: 0.024inch; Width: 0.012inch; Thickness: 0.015inch; RoHS Compliant: Yes; ComponentLink1URL: http://search.murata.co.jp/Ceramy/image/img/A01X/G101/ENG/GRM033R61A225KE47-01.pdf?src-supplier=Digi-Key; ComponentLink1Description: http://search.murata.co.jp/Ceramy/image/img/A01X/G101/ENG/GRM033R61A225KE47-01.pdf?src-supplier=Digi-Key
C13-C16 = GRM033R61A105ME15D: NONE; Manufacturer: Murata; Tolerance: 20%; Voltage Rating: 10V; Dielectric: X5R; AMBIQ PN: GRM033R61A105ME15D; Supplier 1: Arrow Electronics; Supplier Part Number 1: GRM033R61A105ME15D; Manufacturer Part Number: GRM033R61A105ME15D; RoHS: Yes; Category: Ceramic Capacitors; Stock 1: 387591; Pricing 1: 1=0.35440, 10=0.26860, 25=0.26600, 50=0.24050, 100=0.18220, 250=0.18020, 500=0.17800, 1000=0.12040, 3000=0.11920, 6000=0.08160,; Mount: Surface Mount; Case/Package: 0201; Case Code (Metric): 0603; Case Code (Imperial): 0201; Min Operating Temperature: -55°C; Max Operating Temperature: 85°C; Capacitance: 1uF; Packaging: Tape and Reel; Voltage Rating (DC): 10V; Length: 0.024inch; Width: 0.012inch; Thickness: 0.015inch; RoHS Compliant: Yes; ComponentLink1URL: http://search.murata.co.jp/Ceramy/image/img/A01X/G101/ENG/GRM033R61A105ME15-01.pdf?src-supplier=Digi-Key; ComponentLink1Description: http://search.murata.co.jp/Ceramy/image/img/A01X/G101/ENG/GRM033R61A105ME15-01.pdf?src-supplier=Digi-Key
L1 = DFE201210U-2R2M=P2: NONE; Manufacturer: Murata; AMBIQ PN: DFE201210U-2R2M=P2; Supplier 1: Arrow Electronics; Supplier Part Number 1: DFE201210U-2R2M=P2; Manufacturer Part Number: DFE201210U-2R2M=P2; RoHS: Yes; Category: Fixed Inductors; Stock 1: 206; Pricing 1: 1=0.40140, 10=0.29940, 25=0.27320, 100=0.22140 (USD); RoHS Compliant: Yes; ComponentLink1URL: http://search.murata.co.jp/Ceramy/image/img/P02/J(E)TE243A-0029_DFE201210U_reference.pdf?src-supplier=Digi-Key; ComponentLink1Description: http://search.murata.co.jp/Ceramy/image/img/P02/J(E)TE243A-0029_DFE201210U_reference.pdf?src-supplier=Digi-Key; Case/Package: 0805
U1 = APOLLO4P: None; AMBIQ PN: APOLLO4P; Category: Microcontrollers
Y1 = ABM12W-32.0000MHZ-6-D1X-T3: NONE; Manufacturer: Abracon; Load Capacitance: 6pF; ESR (Equivalent Series Resistance): 100R; Frequency Tolerance: 10ppm; Frequency Stability: 20ppm; AMBIQ PN: ABM12W-32.0000MHZ-6-D1X-T3; Supplier 1: Mouser; Supplier Part Number 1: 815-12W32-6D1XT; Manufacturer Part Number: ABM12W-32.0000MHZ-6-D1X-T3; RoHS: Yes; Category: Crystals; Stock 1: 2341; Pricing 1: 1=0.99000, 10=0.88400, 50=0.88400, 100=0.73000, 1000=0.57600, 10000=0.53700 (USD); Mount: Surface Mount; Case/Package: SMD/SMT; Min Operating Temperature: -40°C; Max Operating Temperature: 85°C; Packaging: Tape and Reel; Frequency: 32MHz; ComponentLink1URL: https://abracon.com/Resonators/ABM12W.pdf?src-supplier=Digi-Key; ComponentLink1Description: https://abracon.com/Resonators/ABM12W.pdf?src-supplier=Digi-Key; RoHS Compliant: Yes
Y2 = 9HT12-32.768KDZY-T: NONE; Manufacturer: TXC; Load Capacitance: 7pF; ESR (Equivalent Series Resistance): 90kR; Frequency Tolerance: 20ppm; AMBIQ PN: 9HT12-32.768KDZY-T; Supplier 1: Newark; Supplier Part Number 1: 45AC5777; Manufacturer Part Number: 9HT12-32.768KDZY-T; RoHS: Yes; Category: Crystals; Stock 1: 2496; Pricing 1: 1=1.39000, 10=1.33000, 25=1.26000, 50=1.19000, 100=1.12000 (USD); Mount: Surface Mount; Case/Package: SMD/SMT; Min Operating Temperature: -40°C; Max Operating Temperature: 85°C; Packaging: Tape and Reel; Frequency: 32.768kHz; Length: 0.063inch; Width: 0.039inch; Height: 0.02inch; Lead Free: Lead Free; ComponentLink1URL: http://www.txccrystal.com/images/pdf/number-crystal-khz.pdf?src-supplier=Digi-Key; ComponentLink1Description: http://www.txccrystal.com/images/pdf/number-crystal-khz.pdf?src-supplier=Digi-Key; ComponentLink2URL: http://www.txccrystal.com/images/pdf/9ht12.pdf?src-supplier=Digi-Key; ComponentLink2Description: http://www.txccrystal.com/images/pdf/9ht12.pdf?src-supplier=Digi-Key